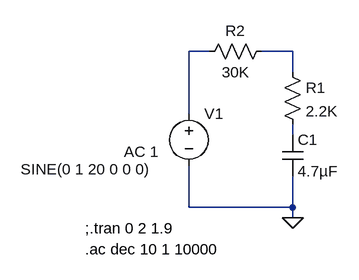
[diagram p0: schematic pll_loop_filt_2.asc]
pll_loop_filt_2.asc, the LTspice schematic file:
Version 4
SHEET 1 880 680
WIRE 48 32 16 32
WIRE 176 32 128 32
WIRE 176 64 176 32
WIRE 16 128 16 32
WIRE 176 160 176 144
WIRE 16 272 16 208
WIRE 176 272 176 224
WIRE 176 272 16 272
WIRE 176 288 176 272
FLAG 176 288 0
SYMBOL res 160 48 R0
SYMATTR InstName R1
SYMATTR Value 2.2K
SYMBOL cap 160 160 R0
SYMATTR InstName C1
SYMATTR Value 4.7µF
SYMBOL voltage 16 112 R0
WINDOW 3 -259 101 Left 2
WINDOW 123 -100 74 Left 2
WINDOW 39 0 0 Left 0
SYMATTR Value SINE(0 1 20 0 0 0)
SYMATTR Value2 AC 1
SYMATTR InstName V1
SYMBOL res 144 16 R90
WINDOW 0 0 56 VBottom 2
WINDOW 3 32 56 VTop 2
SYMATTR InstName R2
SYMATTR Value 30K
TEXT -144 304 Left 2 !;.tran 0 2 1.9
TEXT -144 336 Left 2 !.ac dec 10 1 10000

The netlist it stands for:
* pll_loop_filt_2.asc
R1 N002 N003 2.2K
C1 N003 0 4.7µF
V1 N001 0 SINE(0 1 20 0 0 0) AC 1
R2 N002 N001 30K
;.tran 0 2 1.9
.ac dec 10 1 10000
.backanno
.end